# Altium schematic sheet currentDetection.SchDoc
size A4
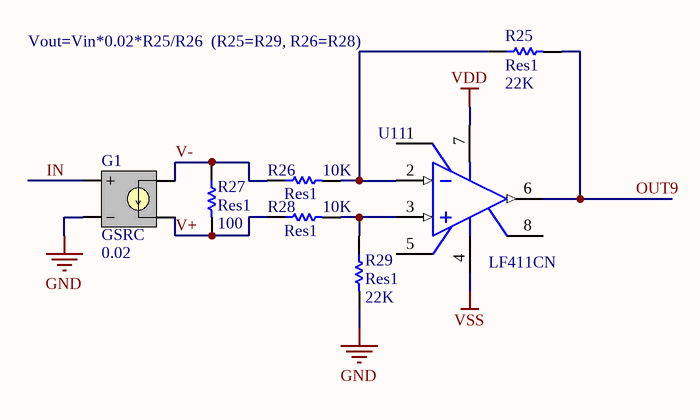
[diagram p0: currentDetection.SchDoc]

## Parts
G1  GSRC  Gain: 0.02
R25  Res1  value 22K  [AXIAL-0.3]
R26  Res1  value 10K  [AXIAL-0.3]
R27  Res1  value 100  [AXIAL-0.3]
R28  Res1  value 10K  [AXIAL-0.3]
R29  Res1  value 22K  [AXIAL-0.3]
U11  LF411CN  [N08E]

## Nets
GND: G1.2(NC-) R29.2
VDD: U11.7(V+)
VSS: U11.4(V-)
IN: G1.1(NC+)
OUT9: R25.2 U11.6(OUT)
V+: G1.4(N-) R27.2 R28.1
V-: G1.3(N+) R26.1 R27.1
NetR25_1: R25.1 R26.2 U11.2(IN-)
NetR28_2: R28.2 R29.1 U11.3(IN+)

Not connected (* = marked no-connect by the designer): U11 1(BAL) 5(BAL) 8(NC)

## Notes on the sheet
- Vout=Vin*0.02*R25/R26  (R25=R29, R26=R28)

## Library data of the parts
G1 = GSRC: Voltage Controlled Current Source; Note: PCB Footprint - Not required; Sim Note: Enter gain into GAIN field; Published: 8-Jun-2000; LatestRevisionDate: 17-Jul-2002; LatestRevisionNote: Re-released for DXP Platform.; PackageReference: Not Applicable; Publisher: Altium Limited
R25-R29 = Res1: Resistor; Published: 8-Jun-2000; LatestRevisionDate: 17-Jul-2002; LatestRevisionNote: Re-released for DXP Platform.; PackageReference: AXIAL-0.3; Publisher: Altium Limited; PackageDescription: Axial Device, Thru-Hole; 2 Leads; 0.3 in Pin Spacing
U11 = LF411CN: Low Offset, Low Drift JFET Input Operational Amplifier, 8-pin MDIP; Manufacturer: National Semiconductor; PackageTopMarking: NSUZXYTTE#*LF*411CN; PowerWise: N; CompType: Amplifiers; Published: 4-Dec-2008; LatestRevisionDate: 13-Jan-2009; LatestRevisionNote: Sim Model Added.; DatasheetVersion: Aug-2000; PackageVersion: revG, May-2006; PackageReference: N08E; Publisher: Altium Limited; PackageDescription: MDIP, .365 x .250 x .130in, 8 Lead, .100in Pitch; Supplier 1: Farnell; Supplier Part Number 1: 9487026; PartNumber: LF411CN; RoHS: N; PinCount: 8; Code_JEDEC: MS-001-BA; ComponentLink1Description: LF411 Datasheet; ComponentLink1URL: http://www.national.com/ds/LF/LF411.pdf; ComponentLink2Description: LF411 Web Page; ComponentLink2URL: http://www.national.com/pf/LF/LF411.html; ComponentLink3Description: N08E Package Page; ComponentLink3URL: http://www.national.com/packaging/folders/n08e.html